# Altium schematic sheet WL-FRONT.SchDoc: WOLF
size 594 x 420 mm; Author: UA3REO; Address1: Address1; Address2: Address2; Address3: Address3; Address4: Address4; DocumentNumber: WOLF-FRONT-UNIT; SheetNumber: 1; Scale: 1:1; DocumentType: Схема электрическая принципиальная; FirstReferrence: UA3REO; Time: WOLF
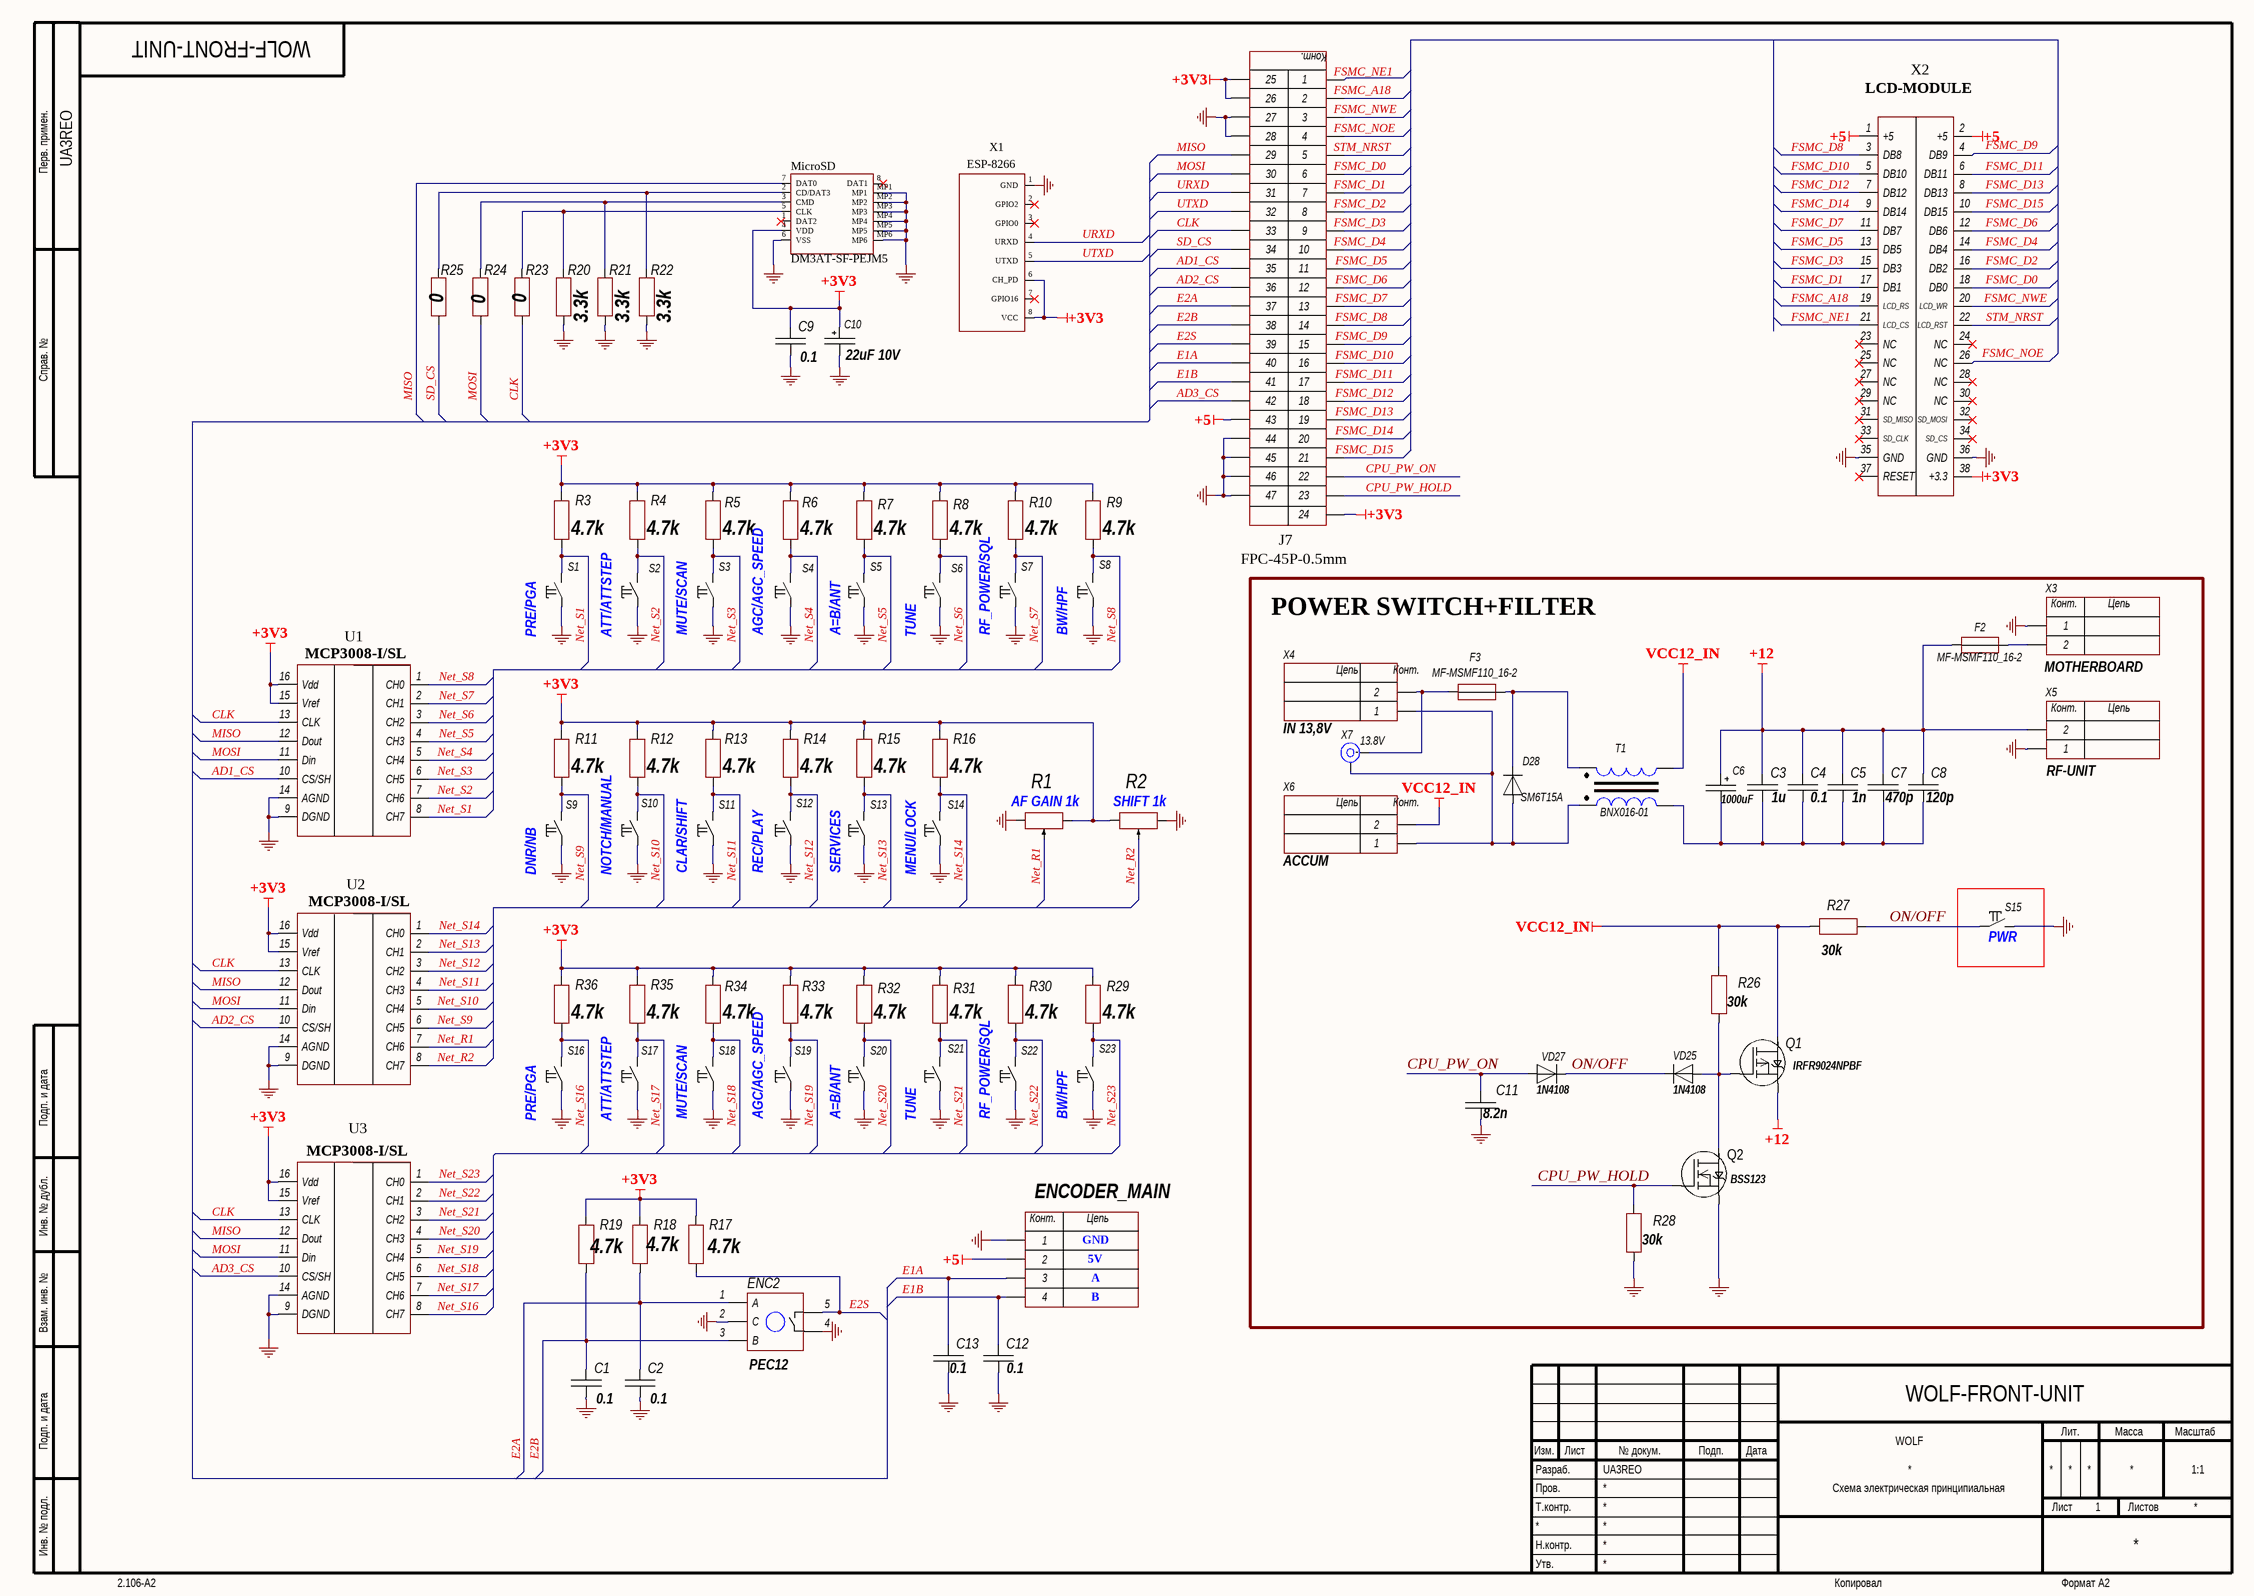
[diagram p0: WL-FRONT.SchDoc]

## Parts
C1  0.1  [CH0805C]
C2  0.1  [CH0805C]
C3  1u  [CH0805C]
C4  0.1  [CH0805C]
C5  1n  [CH0805C]
C6  1000uF  [D5C2H11]
C7  470p  [CH0805C]
C8  120p  [CH0805C]
C9  0.1  [CH0805C]
C10  22uF 10V  [TANTAL_B]
C11  8.2n  [CH0805C]
C12  0.1  [CH0805C]
C13  0.1  [CH0805C]
D28  SM6T15A  [SOD123]
ENC2  PEC12  [ENC: PEC-12]
ENCODER_MAIN  *  [CON: 0010321041]  (value not drawn)
F2  MF-MSMF110_16-2  [CH0603F]
F3  MF-MSMF110_16-2  [CH0603F]
J7  FPC-45P-0.5mm  [FPC-45-0.5]
MicroSD  DM3AT-SF-PEJM5
Q1  IRFR9024NPBF  [D2PAK_132]
Q2  BSS123  [SOT23_132]
R1  AF GAIN 1k  [RES: 3296W]
R2  SHIFT 1k  [RES: 3296W]
R3  4.7k  [CH0805R]
R4  4.7k  [CH0805R]
R5  4.7k  [CH0805R]
R6  4.7k  [CH0805R]
R7  4.7k  [CH0805R]
R8  4.7k  [CH0805R]
R9  4.7k  [CH0805R]
R10  4.7k  [CH0805R]
R11  4.7k  [CH0805R]
R12  4.7k  [CH0805R]
R13  4.7k  [CH0805R]
R14  4.7k  [CH0805R]
R15  4.7k  [CH0805R]
R16  4.7k  [CH0805R]
R17  4.7k  [CH0805R]
R18  4.7k  [CH0805R]
R19  4.7k  [CH0805R]
R20  3.3k  [CH0805R]
R21  3.3k  [CH0805R]
R22  3.3k  [CH0805R]
R23  0  [CH0805R]
R24  0  [CH0805R]
R25  0  [CH0805R]
R26  30k  [CH0805R]
R27  30k  [CH0805R]
R28  30k  [CH0805R]
R29  4.7k  [CH0805R]
R30  4.7k  [CH0805R]
R31  4.7k  [CH0805R]
R32  4.7k  [CH0805R]
R33  4.7k  [CH0805R]
R34  4.7k  [CH0805R]
R35  4.7k  [CH0805R]
R36  4.7k  [CH0805R]
S1  PRE/PGA  [Botoom-1]
S2  ATT/ATTSTEP  [Botoom-1]
S3  MUTE/SCAN  [Botoom-1]
S4  AGC/AGC_SPEED  [Botoom-1]
S5  A=B/ANT  [Botoom-1]
S6  TUNE  [Botoom-1]
S7  RF_POWER/SQL  [Botoom-1]
S8  BW/HPF  [Botoom-1]
S9  DNR/NB  [Botoom-1]
S10  NOTCH/MANUAL  [Botoom-1]
S11  CLAR/SHIFT  [Botoom-1]
S12  REC/PLAY  [Botoom-1]
S13  SERVICES  [Botoom-1]
S14  MENU/LOCK  [Botoom-1]
S15  PWR  [Botoom-1]
S16  PRE/PGA  [Botoom-1]
S17  ATT/ATTSTEP  [Botoom-1]
S18  MUTE/SCAN  [Botoom-1]
S19  AGC/AGC_SPEED  [Botoom-1]
S20  A=B/ANT  [Botoom-1]
S21  TUNE  [Botoom-1]
S22  RF_POWER/SQL  [Botoom-1]
S23  BW/HPF  [Botoom-1]
T1  BNX016-01  [TRANS: DLW21]
U1  MCP3008-I/SL  [16-SOIC]
U2  MCP3008-I/SL  [16-SOIC]
U3  MCP3008-I/SL  [16-SOIC]
VD25  1N4108  [1N4148]
VD27  1N4108  [1N4148]
X1  ESP-8266
X2  LCD-MODULE  [TFT3.2-320x480-pin]
X3  MOTHERBOARD  [CON: 300-02P-5.0]
X4  IN 13,8V  [CON: 300-02P-5.0]
X5  RF-UNIT  [CON: 300-02P-5.0]
X6  ACCUM  [CON: 300-02P-5.0]
X7  13.8V  [CON: PJ-102AH]

## Blocks framed on the sheet
POWER SWITCH+FILTER: C3-C8 C11 D28 F2 F3 Q1 Q2 R26-R28 S15 T1 VD25 VD27 X3-X7

## Nets
+3V3: C9.2 C10.1 J7.24 J7.25 J7.26 MicroSD.4(VDD) R1.3 R2.1 R3.2 R4.2 R5.2 R6.2 R7.2 R8.2 R9.2 R10.2 R11.2 R12.2 R13.2 R14.2 R15.2 R16.2 R17.2 R18.2 R19.2 R29.2 R30.2 R31.2 R32.2 R33.2 R34.2 R35.2 R36.2 U1.15(Vref) U1.16(Vdd) U2.15(Vref) U2.16(Vdd) U3.15(Vref) U3.16(Vdd) X1.6(CH_PD) X1.8(VCC) X2.38(+3.3)
+5: ENCODER_MAIN.2 J7.43 X2.1(+5) X2.2(+5)
+12: C3.2 C4.2 C5.2 C6.1 C7.2 C8.2 F2.1 Q1.2(I) X5.2
GND: C1.1 C2.1 C9.1 C10.2 C11.2 C12.1 C13.1 ENC2.2(C) ENC2.4 ENCODER_MAIN.1 J7.27 J7.28 J7.44 J7.45 J7.46 J7.47 MicroSD.6(VSS) MicroSD.MP1 MicroSD.MP2 MicroSD.MP3 MicroSD.MP4 MicroSD.MP5 MicroSD.MP6 Q2.2(I) R1.1 R2.3 R20.1 R21.1 R22.1 R28.1 S1.1 S2.1 S3.1 S4.1 S5.1 S6.1 S7.1 S8.1 S9.1 S10.1 S11.1 S12.1 S13.1 S14.1 S15.2 S16.1 S17.1 S18.1 S19.1 S20.1 S21.1 S22.1 S23.1 U1.9(DGND) U1.14(AGND) U2.9(DGND) U2.14(AGND) U3.9(DGND) U3.14(AGND) X1.1(GND) X2.35(GND) X2.36(GND) X3.1 X5.1
VCC12_IN: Q1.3(Сток(Drain)) R26.2 R27.2 T1.2 X6.2
AD1_CS: J7.35 U1.10(CS/SH)
AD2_CS: J7.36 U2.10(CS/SH)
AD3_CS: J7.42 U3.10(CS/SH)
CLK: J7.33 R23.2 U1.13(CLK) U2.13(CLK) U3.13(CLK)
CPU_PW_HOLD: J7.23 Q2.1(Затвор(Gate)) R28.2
CPU_PW_ON: C11.1 J7.22 VD27.1
E1A: C13.2 ENCODER_MAIN.3 J7.40
E1B: C12.2 ENCODER_MAIN.4 J7.41
E2A: C2.2 ENC2.1(A) J7.37 R18.1
E2B: C1.2 ENC2.3(B) J7.38 R19.1
E2S: ENC2.5 J7.39 R17.1
FSMC_A18: X2.19(LCD_RS)
FSMC_D0: X2.18(DB0)
FSMC_D1: X2.17(DB1)
FSMC_D2: X2.16(DB2)
FSMC_D3: X2.15(DB3)
FSMC_D4: X2.14(DB4)
FSMC_D5: X2.13(DB5)
FSMC_D6: X2.12(DB6)
FSMC_D7: X2.11(DB7)
FSMC_D8: X2.3(DB8)
FSMC_D9: X2.4(DB9)
FSMC_D10: X2.5(DB10)
FSMC_D11: X2.6(DB11)
FSMC_D12: X2.7(DB12)
FSMC_D13: X2.8(DB13)
FSMC_D14: X2.9(DB14)
FSMC_D15: X2.10(DB15)
FSMC_NE1: X2.21(LCD_CS)
FSMC_NOE: X2.26(NC)
FSMC_NWE: X2.20(LCD_WR)
MISO: J7.29 MicroSD.7(DAT0) U1.12(Dout) U2.12(Dout) U3.12(Dout)
MOSI: J7.30 R24.2 U1.11(Din) U2.11(Din) U3.11(Din)
Net_R1: R1.2 U2.7(CH6)
Net_R2: R2.2 U2.8(CH7)
Net_S1: R3.1 S1.2 U1.8(CH7)
Net_S2: R4.1 S2.2 U1.7(CH6)
Net_S3: R5.1 S3.2 U1.6(CH5)
Net_S4: R6.1 S4.2 U1.5(CH4)
Net_S5: R7.1 S5.2 U1.4(CH3)
Net_S6: R8.1 S6.2 U1.3(CH2)
Net_S7: R10.1 S7.2 U1.2(CH1)
Net_S8: R9.1 S8.2 U1.1(CH0)
Net_S9: R11.1 S9.2 U2.6(CH5)
Net_S10: R12.1 S10.2 U2.5(CH4)
Net_S11: R13.1 S11.2 U2.4(CH3)
Net_S12: R14.1 S12.2 U2.3(CH2)
Net_S13: R15.1 S13.2 U2.2(CH1)
Net_S14: R16.1 S14.2 U2.1(CH0)
Net_S16: R36.1 S16.2 U3.8(CH7)
Net_S17: R35.1 S17.2 U3.7(CH6)
Net_S18: R34.1 S18.2 U3.6(CH5)
Net_S19: R33.1 S19.2 U3.5(CH4)
Net_S20: R32.1 S20.2 U3.4(CH3)
Net_S21: R31.1 S21.2 U3.3(CH2)
Net_S22: R30.1 S22.2 U3.2(CH1)
Net_S23: R29.1 S23.2 U3.1(CH0)
ON/OFF: R27.1 S15.1 VD25.2 VD27.2
SD_CS: J7.34 R25.2
STM_NRST: X2.22(LCD_RST)
URXD: J7.31 X1.4(URXD)
UTXD: J7.32 X1.5(UTXD)
NetC3_1: C3.1 C4.1 C5.1 C6.2 C7.1 C8.1 T1.4
NetD28_1: D28.1 T1.3 X4.1 X6.1 X7.2(IN)
NetD28_2: D28.2 F3.2 T1.1
NetF2_2: F2.2 X3.2
NetF3_1: F3.1 X4.2 X7.1(IN)
NetMicroSD_2: MicroSD.2(CD/DAT3) R22.2 R25.1
NetMicroSD_3: MicroSD.3(CMD) R21.2 R24.1
NetMicroSD_5: MicroSD.5(CLK) R20.2 R23.1
NetQ1_1: Q1.1(Затвор(Gate)) Q2.3(Сток(Drain)) R26.1 VD25.1

Not connected (* = marked no-connect by the designer): J7 1 2 3 4 5 6 7 8 9 10 11 12 13 14 15 16 17 18 19 20 21; MicroSD 1(DAT2)* 8(DAT1)*; X1 2(GPIO2)* 3(GPIO0)* 7(GPIO16)*; X2 23(NC)* 24(NC)* 25(NC)* 27(NC)* 28(NC)* 29(NC)* 30(NC)* 31(SD_MISO)* 32(SD_MOSI)* 33(SD_CLK)* 34(SD_CS)* 37(RESET)*

## Notes on the sheet
- GND
- 5V
- A
- B
- Labels drawn without touching a wire or pin: FSMC_A18, FSMC_D0, FSMC_D1, FSMC_D2, FSMC_D3, FSMC_D4, FSMC_D5, FSMC_D6, FSMC_D7, FSMC_D8, FSMC_D9, FSMC_D10, FSMC_D11, FSMC_D12, FSMC_D13, FSMC_D14, FSMC_D15, FSMC_NE1, FSMC_NOE, FSMC_NWE, STM_NRST
- Перв. примен.
- Справ. №
- Подп. и дата
- Инв. № дубл.
- Взам. инв. №
- Разраб.
- Изм.
- Лист
- № докум.
- Подп.
- Дата
- Лит.
- Масса
- Масштаб
- Пров.
- Т.контр.
- Листов
- Инв. № подл.
- Утв.
- Н.контр.
- 2.106-A2
- Копировал
- Формат А2
- (in symbol 2-Connector) Конт.; Цепь
- (in symbol 4-Connector) Конт.; Цепь
- (in symbol 47-PIN) Конт.

## Library data of the parts
C1-C5 C7-C9 C11-C13 = Capacitor: Manufacturer: *; Model: *; HelpURL: *; ComponentKind: *; Value: *
C6 = AlumCap: Manufacturer: *; Model: *; HelpURL: *; ComponentKind: *; Value: *
C10 = TantalCap: Manufacturer: *; Model: *; HelpURL: *; ComponentKind: *; Value: *
D28 VD25 VD27 = Diod: ComponentKind: *; Manufacturer: *; Model: *; HelpURL: *
ENC2 = PEC12: Encoder; Model: *; Manufacturer: *; HelpURL: *; ComponentKind: *
ENCODER_MAIN = 4-Connector: Model: *; Manufacturer: *; HelpURL: *; ComponentKind: *
F2 F3 = Fuse: Manufacturer: *; Model: *; HelpURL: *; ComponentKind: *; Value: *
J7 = 47-PIN
MicroSD = MicroSD
Q1 = P-KANAL
Q2 = N-KANAL
R1 R2 = ADJ resistor: Manufacturer: *; Model: *; HelpURL: *; ComponentKind: *; Value: *
R3-R36 = Resistor: Manufacturer: *; Model: *; HelpURL: *; ComponentKind: *; Value: *
S1-S23 = Tactile switches: 6x6 mm; Manufacturer: *; Model: *; HelpURL: *; ComponentKind: *
T1 = EMI bead: Manufacturer: Murata Electronics North America; Model: DLW21SN900SQ2L; HelpURL: https://www.digikey.com/product-detail/en/murata-electronics-north-america/DLW21SN900SQ2L/490-5137-1-ND/1922888; ComponentKind: Bead
X3-X6 = 2-Connector: Model: *; Manufacturer: *; HelpURL: *; ComponentKind: *
X7 = Power: RF; Manufacturer: CUI Inc.; Model: PJ-102AH; HelpURL: https://www.digikey.com/products/en?keywords=cp-102AH-ND; ComponentKind: 24VDC